# EAGLE design dip28_a2 (EAGLE 5.11)
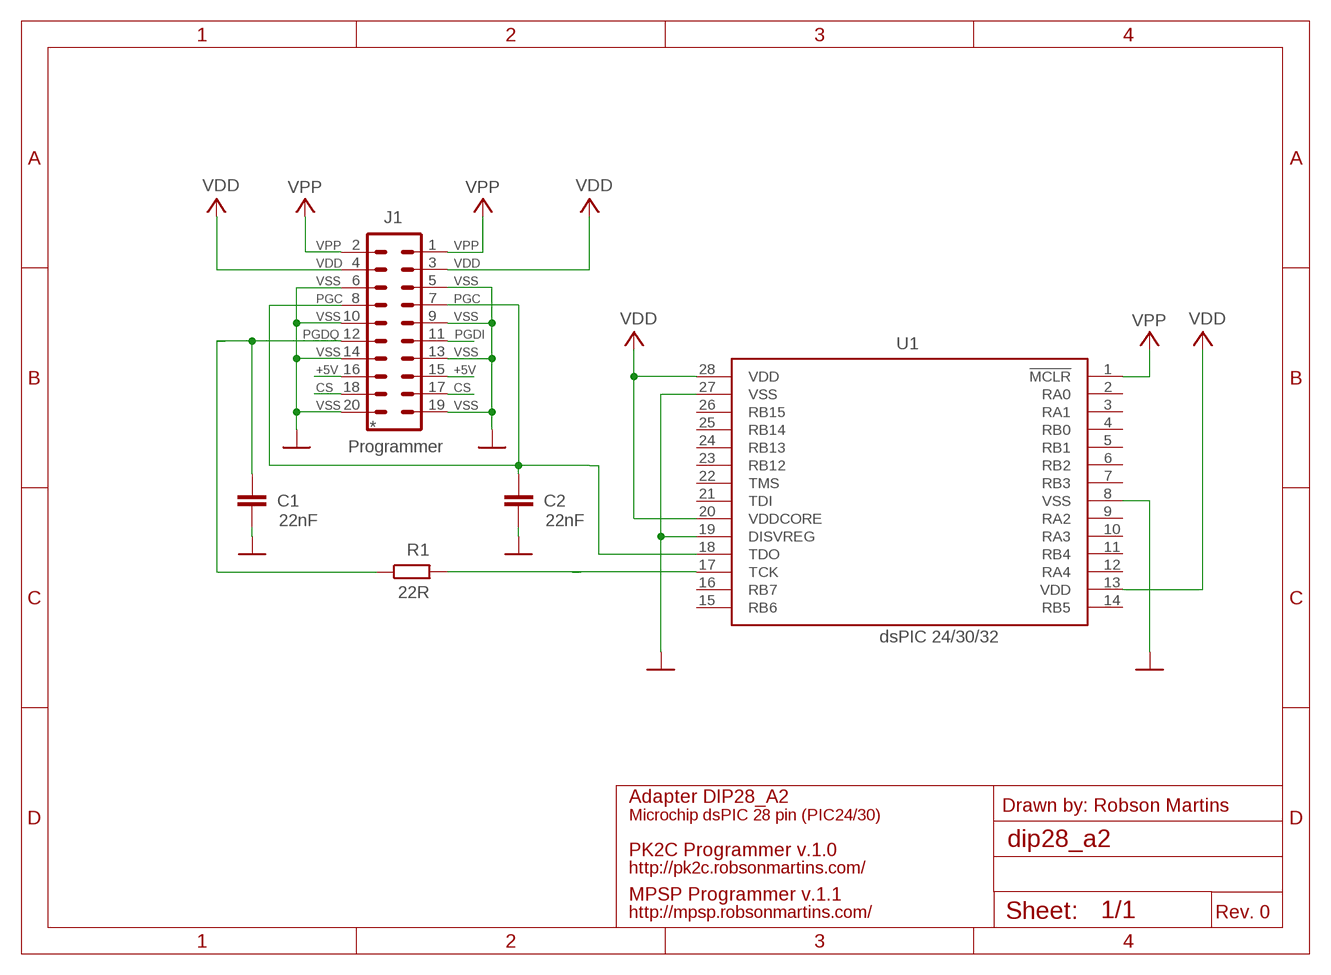
[diagram p0: schematic, sheet 1]

## Parts
C1  22nF  C-EU025-025X050  [C025-025X050]
C2  22nF  C-EU025-025X050  [C025-025X050]
J1  Programmer  MA10-2  [MA10-2]
R1  22R  R-EU_0204/7  [0204/7]
U1  dsPIC 24/30/32  PIC24FJ16GA002  [DIL28-3]

## Nets
+5V: J1.15 J1.16
CS: J1.17 J1.18
GND: C1.2 C2.2 J1.5 J1.6 J1.9 J1.10 J1.13 J1.14 J1.19 J1.20 U1.8(VSS) U1.19(DISVREG) U1.27(VSS)
PGC: C2.1 J1.7 J1.8 U1.18(TDO)
PGD: C1.1 J1.12 R1.1
PGD_CHIP: R1.2 U1.17(TCK)
PGDI: J1.11
VDD: J1.3 J1.4 U1.13(VDD) U1.20(VDDCORE) U1.28(VDD)
VPP: J1.1 J1.2 U1.1(!MCLR)
Unconnected: U1.2(RA0) U1.3(RA1) U1.4(RB0) U1.5(RB1) U1.6(RB2) U1.7(RB3) U1.9(RA2) U1.10(RA3) U1.11(RB4) U1.12(RA4) U1.14(RB5) U1.15(RB6) U1.16(RB7) U1.21(TDI) U1.22(TMS) U1.23(RB12) U1.24(RB13) U1.25(RB14) U1.26(RB15)

## Notes on the sheet
- VPP | VPP
- VDD | VDD
- VSS | VSS
- PGC | PGC
- VSS | VSS
- PGDQ | PGDI
- VSS | VSS
- +5V | +5V
- CS | CS
- VSS | VSS
- *
- Adapter DIP28_A2
- Drawn by: Robson Martins
- Microchip dsPIC 28 pin (PIC24/30)
- PK2C Programmer v.1.0
- http://pk2c.robsonmartins.com/
- MPSP Programmer v.1.1
- http://mpsp.robsonmartins.com/ | Rev. 0

## Library data of the parts
C1 C2 = rcl:C-EU: CAPACITOR, European symbol
J1 = con-lstb:MA10-2: PIN HEADER; OC_FARNELL: unknown; OC_NEWARK: unknown
R1 = resistor:R-EU_: RESISTOR, European symbol
U1 = microchip:PIC24FJ16GA002: PIC24FJ16GA002 edit this description Auto generated by make-symbol-device-package-bsdl.ulp Rev. 25 Source: PIC24FJ16GA002.bsd; MPN: PIC24FJ16GA002-I/SP; OC_FARNELL: 1816078; OC_NEWARK: 40M1427

## Board
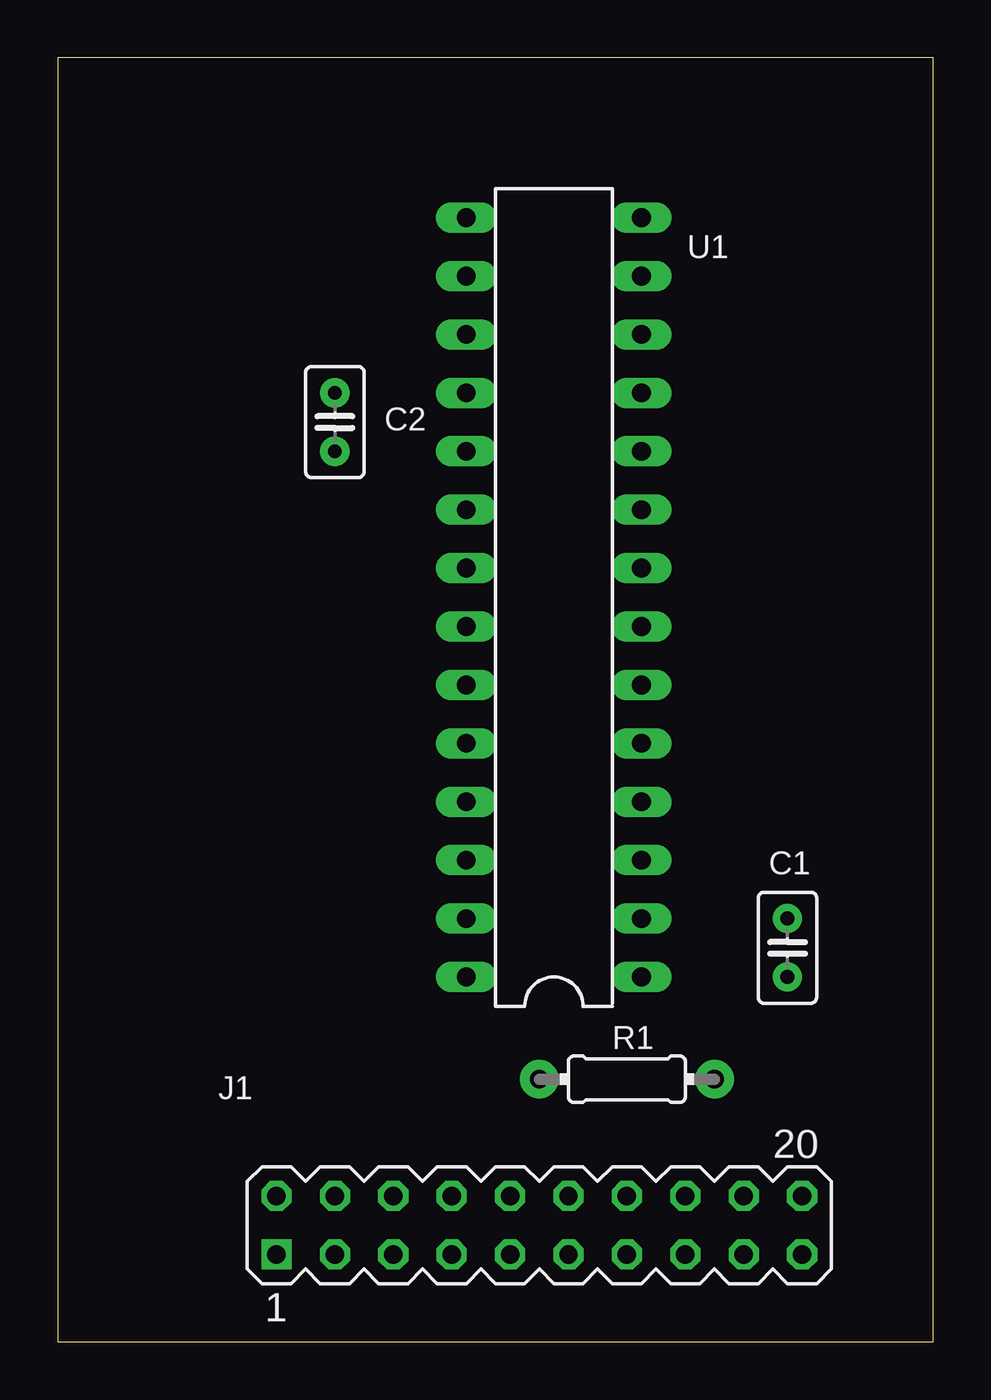
[diagram p1: board, top side]
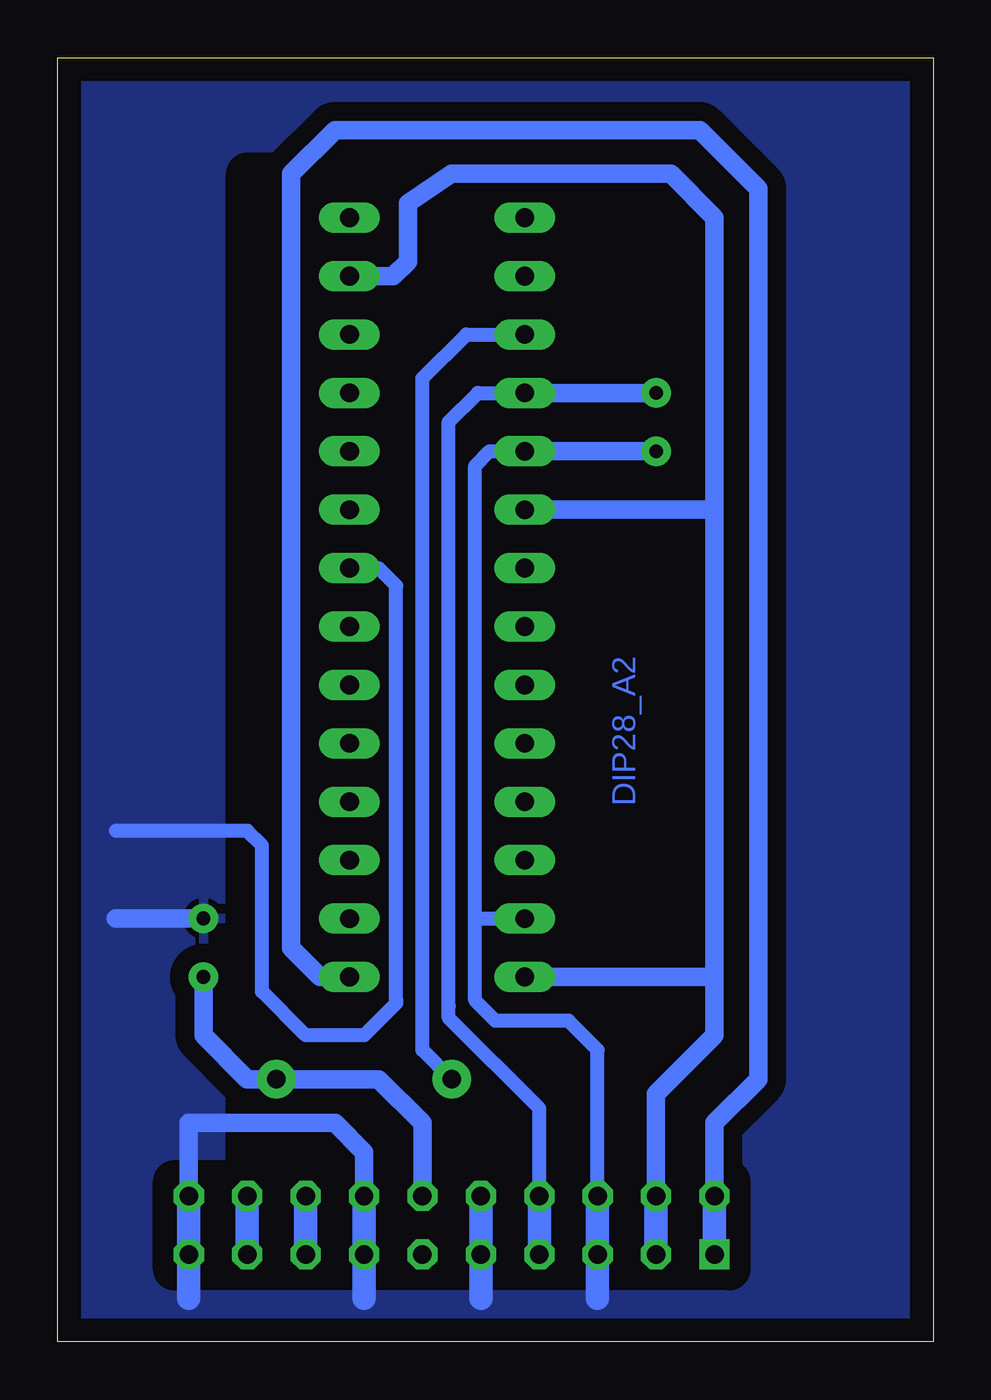
[diagram p2: board, bottom side, seen from below]

Size 38.1 x 55.86 mm. Coordinates in mm from the lower left corner, seen from the top.
Outline: 38.1,0 38.1,55.86 0,55.86 0,0 38.1,0
Copper layers (1*16): Top 0.035mm / dielectric 1.5mm / Bottom 0.035mm
Design rules "default": minimum track width 10mil, minimum drill 24mil, track to track 8mil, track to pad 8mil, pad to pad 8mil, via to via 8mil, smd to smd 8mil, copper to edge 40mil, drill to drill 8mil, minimum pad ring 10mil, minimum via ring 8mil, stop-mask expansion 4mil, vias tented up to drill 0mil, thermal gap 10mil
bRestrict: area 8.9,3.2 to 33,13.3; area 9.5,13.3 to 29.8,50.8

### Footprints (pad centres in the part's own frame; a part is rotated, then mirrored left to right if it is on the bottom)
C025-025X050 = drill 0.6 pad 1.27 round: 1 -1.27,0; 2 1.27,0
MA10-2 = drill 0.8 pad 1.27 square: 1 -11.43,-1.27 | drill 0.8 pad 1.27 octagon: 2 -11.43,1.27; 3 -8.89,-1.27; 4 -8.89,1.27; 5 -6.35,-1.27; 6 -6.35,1.27; 7 -3.81,-1.27; 8 -3.81,1.27; 9 -1.27,-1.27; 10 -1.27,1.27; 11 1.27,-1.27; 12 1.27,1.27; 13 3.81,-1.27; 14 3.81,1.27; 15 6.35,-1.27; 16 6.35,1.27; 17 8.89,-1.27; 18 8.89,1.27; 19 11.43,-1.27; 20 11.43,1.27
0204/7 = drill 0.813 pad 1.676 round: 1 -3.81,0 | drill 0.8 pad 1.676 round: 2 3.81,0
DIL28-3 = drill 0.813 long: 1 -16.51,-3.81; 2 -13.97,-3.81; 3 -11.43,-3.81; 4 -8.89,-3.81; 5 -6.35,-3.81; 6 -3.81,-3.81; 7 -1.27,-3.81; 8 1.27,-3.81; 9 3.81,-3.81; 10 6.35,-3.81; 11 8.89,-3.81; 12 11.43,-3.81; 13 13.97,-3.81; 14 16.51,-3.81; 15 16.51,3.81; 16 13.97,3.81; 17 11.43,3.81; 18 8.89,3.81; 19 6.35,3.81; 20 3.81,3.81; 21 1.27,3.81; 22 -1.27,3.81; 23 -3.81,3.81; 24 -6.35,3.81; 25 -8.89,3.81; 26 -11.43,3.81; 27 -13.97,3.81; 28 -16.51,3.81

### Placement (x,y rotation side)
C1  31.75,17.14 90 top
C2  12.07,40.01 270 top
J1  20.96,5.08 0 top
R1  24.77,11.43 180 top
U1  21.59,32.38 90 top

### Tracks (layer width: path | path; a pad name or v marks a point on that pad's centre or on a via)
+5V
  Bottom 1.016: J1.15 J1.16
CS
  Bottom 1.016: J1.17 J1.18
GND
  Bottom 0.61: J1.6 14.61,12.7 15.88,13.97 19.05,13.97 19.94,14.86 19.94,18.41 | 19.94,18.41 19.94,38.1 19.3,38.73 U1.19 | 19.94,18.41 U1.27 | U1.8 24.13,33.66 23.37,32.89 23.37,14.86 23.37,14.73 24.77,13.34 27.31,13.34 29.21,15.24 29.21,21.59 29.85,22.23 35.56,22.23
  Bottom 0.813: J1.14 24.77,8.26 26.04,9.53 32.39,9.53 J1.20 | C1.2 35.56,18.41 | U1.19 C2.2
  Bottom 1.016: J1.6 J1.5 14.61,1.91 | J1.10 J1.9 19.69,1.91 | J1.14 J1.13 24.77,1.91 | J1.20 J1.19 32.39,1.91
  pour Bottom (isolate 0.813): 38.1,0 0,0 0,55.88 38.1,55.88
PGC
  Bottom 0.61: J1.8 17.15,10.16 21.08,14.1 21.08,14.61 21.08,40.01 19.81,41.27 U1.18
  Bottom 0.813: U1.18 C2.1
  Bottom 1.016: J1.7 J1.8
PGD
  Bottom 0.813: J1.12 22.23,8.89 22.23,9.53 24.13,11.43 R1.1 29.85,11.43 31.75,13.34 C1.1
PGD_CHIP
  Bottom 0.61: R1.2 22.23,12.7 22.23,13.34 22.23,41.91 20.32,43.81 U1.17
VDD
  Bottom 0.813: J1.4 12.07,7.62 12.07,8.89 12.07,10.79 9.53,13.34 9.53,15.88 | 9.53,15.88 9.53,36.2 | 9.53,36.2 9.53,48.9 11.43,50.8 12.07,50.8 20.96,50.8 22.86,49.53 22.86,47.62 22.86,46.99 23.5,46.35 U1.13 | 9.53,15.88 U1.28 | 9.53,36.2 U1.20
  Bottom 1.016: J1.3 J1.4
VPP
  Bottom 0.813: J1.1 9.53,7.62 9.53,9.53 7.62,11.43 7.62,48.9 7.62,50.16 10.16,52.7 10.8,52.7 24.77,52.7 26.04,52.7 27.94,50.8 27.94,17.14 26.67,15.88 U1.1
  Bottom 1.016: J1.1 J1.2

### Text on the board
Bottom: DIP28_A2
tDocu: Microchip PIC | dsPIC 24/30/32 | DIP28_A2 | Adapter | VSS | VPP | VDD | VSS | PGC | VSS | PGD | VSS | +5V | CS